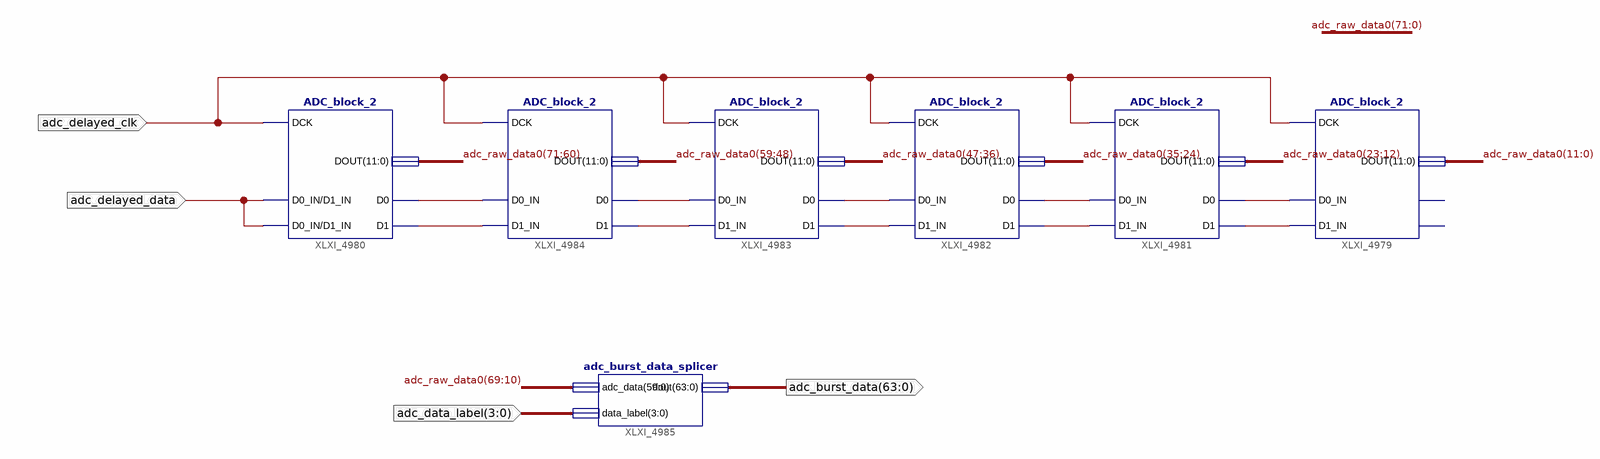
[diagram p0: schematic sheet 1]
// Xilinx ISE schematic ADC_snapshot_block.sch (virtex4) as structural Verilog: 7 symbols, 4 ports
module ADC_snapshot_block (
  input  adc_delayed_data,
  input  adc_delayed_clk,
  input  [3:0] adc_data_label,
  output [63:0] adc_burst_data
);

  wire XLXN_12534, XLXN_12535, XLXN_12536, XLXN_12537, XLXN_12538, XLXN_12539, XLXN_12540, XLXN_12541,
       XLXN_14590, XLXN_14591;
  wire [71:0] adc_raw_data0;

  ADC_block_2 XLXI_4979 (
    .DCK(adc_delayed_clk), .D0_IN(XLXN_14590), .D1_IN(XLXN_14591), .DOUT(adc_raw_data0[11:0]));  // open: D0, D1
  ADC_block_2 XLXI_4980 (
    .DCK(adc_delayed_clk), .D0_IN(adc_delayed_data), .D1_IN(adc_delayed_data), .D0(XLXN_12534),
    .D1(XLXN_12535), .DOUT(adc_raw_data0[71:60]));
  ADC_block_2 XLXI_4981 (
    .DCK(adc_delayed_clk), .D0_IN(XLXN_12540), .D1_IN(XLXN_12541), .D0(XLXN_14590), .D1(XLXN_14591),
    .DOUT(adc_raw_data0[23:12]));
  ADC_block_2 XLXI_4982 (
    .DCK(adc_delayed_clk), .D0_IN(XLXN_12538), .D1_IN(XLXN_12539), .D0(XLXN_12540), .D1(XLXN_12541),
    .DOUT(adc_raw_data0[35:24]));
  ADC_block_2 XLXI_4983 (
    .DCK(adc_delayed_clk), .D0_IN(XLXN_12536), .D1_IN(XLXN_12537), .D0(XLXN_12538), .D1(XLXN_12539),
    .DOUT(adc_raw_data0[47:36]));
  ADC_block_2 XLXI_4984 (
    .DCK(adc_delayed_clk), .D0_IN(XLXN_12534), .D1_IN(XLXN_12535), .D0(XLXN_12536), .D1(XLXN_12537),
    .DOUT(adc_raw_data0[59:48]));
  adc_burst_data_splicer XLXI_4985 (
    .adc_data(adc_raw_data0[69:10]), .data_label(adc_data_label), .dout(adc_burst_data));
endmodule
